# Altium schematic sheet Power.SchDoc: POWER BOARD
size C; DocumentNumber: 32; SheetNumber: 32; SheetTotal: 46
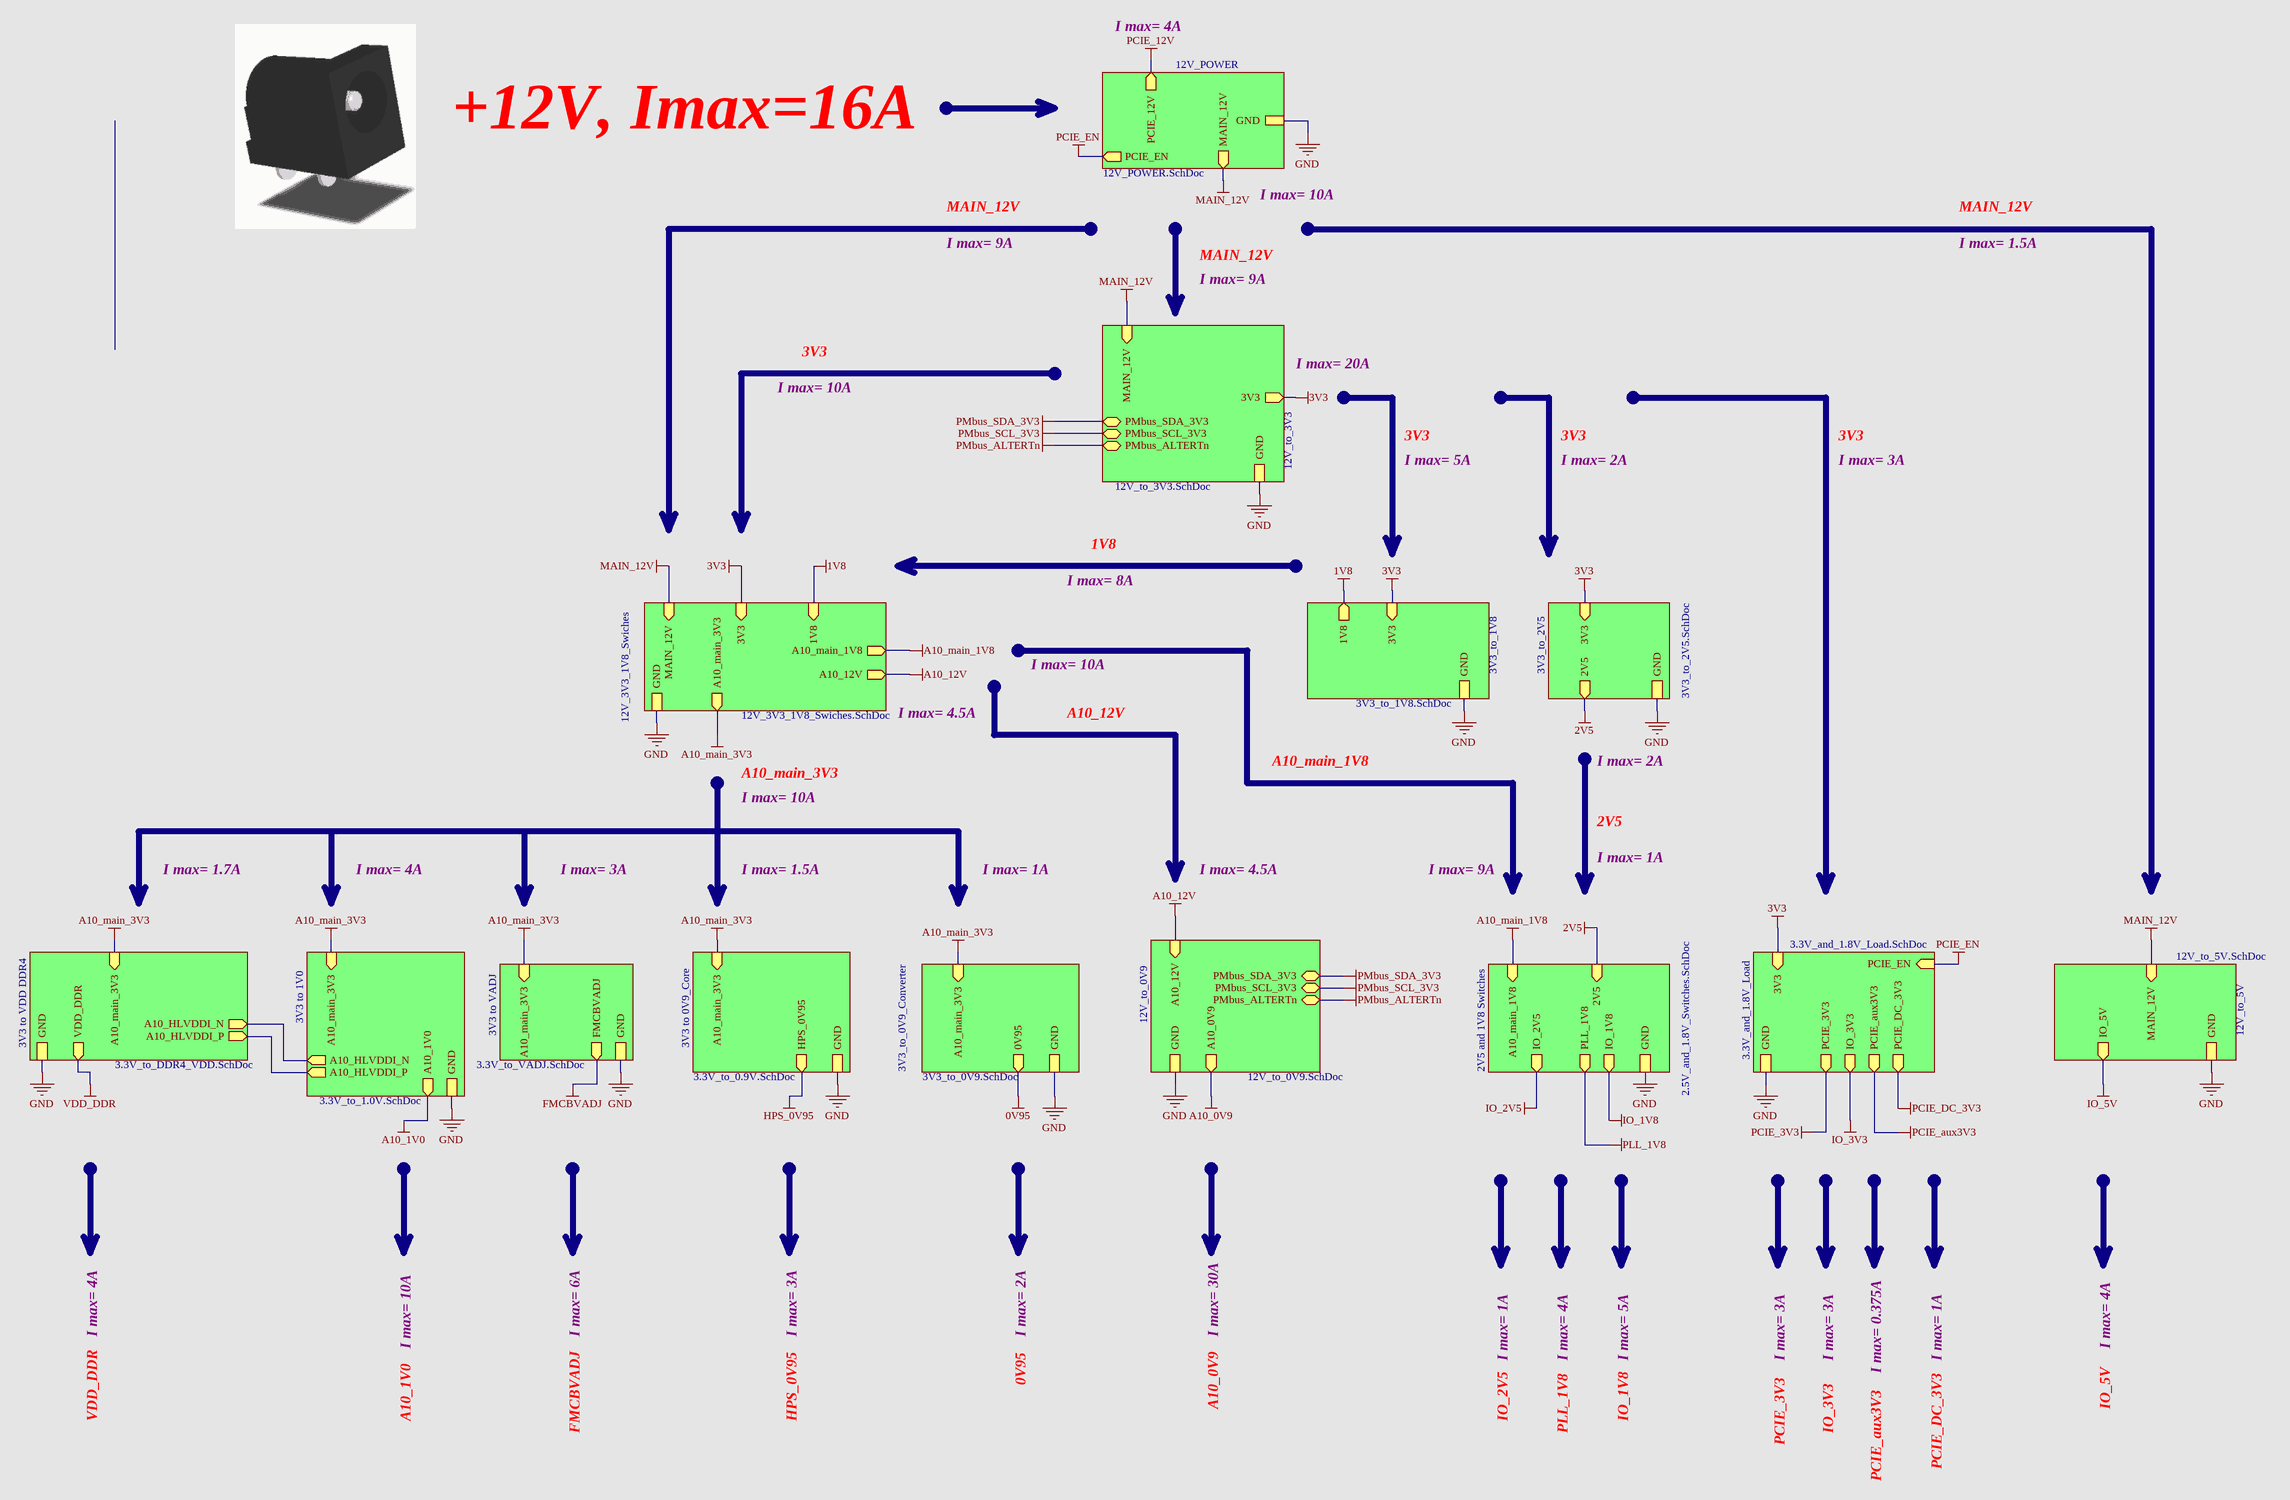
[diagram p0: Power.SchDoc]

## Sub-sheets
2V5 and 1V8 Switches = 2.5V_and_1.8V_Switches.SchDoc: 2V5 (in), IO_2V5 (out), A10_main_1V8 (in), PLL_1V8 (out), IO_1V8 (out), GND
3.3V_and_1.8V_Load = 3.3V_and_1.8V_Load.SchDoc: PCIE_EN (in), 3V3 (in), PCIE_3V3 (out), IO_3V3 (out), PCIE_aux3V3 (out), PCIE_DC_3V3 (out), GND
3V3 to 0V9_Core = 3.3V_to_0.9V.SchDoc: A10_main_3V3 (in), HPS_0V95 (out), GND
3V3 to 1V0 = 3.3V_to_1.0V.SchDoc: A10_HLVDDI_P (out), A10_HLVDDI_N (out), A10_main_3V3 (in), A10_1V0 (out), GND
3V3 to VADJ = 3.3V_to_VADJ.SchDoc: A10_main_3V3 (in), FMCBVADJ (out), GND
3V3 to VDD DDR4 = 3.3V_to_DDR4_VDD.SchDoc: A10_HLVDDI_P (out), A10_HLVDDI_N (out), A10_main_3V3 (in), VDD_DDR (out), GND
3V3_to_0V9_Converter = 3V3_to_0V9.SchDoc: A10_main_3V3 (in), 0V95 (out), GND
3V3_to_1V8 = 3V3_to_1V8.SchDoc: 1V8 (out), 3V3 (in), GND
3V3_to_2V5 = 3V3_to_2V5.SchDoc: 3V3 (in), 2V5 (out), GND
12V_3V3_1V8_Swiches = 12V_3V3_1V8_Swiches.SchDoc: MAIN_12V (in), A10_12V (out), 3V3 (in), A10_main_3V3 (out), 1V8 (in), A10_main_1V8 (out), GND
12V_POWER = 12V_POWER.SchDoc: PCIE_EN (out), MAIN_12V (out), PCIE_12V (out), GND
12V_to_0V9 = 12V_to_0V9.SchDoc: PMbus_SDA_3V3 (bidir), PMbus_SCL_3V3 (bidir), PMbus_ALTERTn (bidir), A10_12V (in), A10_0V9 (out), GND
12V_to_3V3 = 12V_to_3V3.SchDoc: PMbus_SDA_3V3 (bidir), PMbus_SCL_3V3 (bidir), PMbus_ALTERTn (bidir), MAIN_12V (in), 3V3 (out), GND
12V_to_5V = 12V_to_5V.SchDoc: IO_5V (out), MAIN_12V (in), GND

## Nets
0V95: sheet 3V3_to_0V9_Converter/0V95
1V8: sheet 12V_3V3_1V8_Swiches/1V8, sheet 3V3_to_1V8/1V8
2V5: sheet 3V3_to_2V5/2V5, sheet 2V5 and 1V8 Switches/2V5
3V3: sheet 12V_3V3_1V8_Swiches/3V3, sheet 12V_to_3V3/3V3, sheet 3V3_to_2V5/3V3, sheet 3V3_to_1V8/3V3, sheet 3.3V_and_1.8V_Load/3V3
A10_0V9: sheet 12V_to_0V9/A10_0V9
A10_1V0: sheet 3V3 to 1V0/A10_1V0
A10_12V: sheet 12V_3V3_1V8_Swiches/A10_12V, sheet 12V_to_0V9/A10_12V
A10_main_1V8: sheet 12V_3V3_1V8_Swiches/A10_main_1V8, sheet 2V5 and 1V8 Switches/A10_main_1V8
A10_main_3V3: sheet 12V_3V3_1V8_Swiches/A10_main_3V3, sheet 3V3 to 0V9_Core/A10_main_3V3, sheet 3V3 to 1V0/A10_main_3V3, sheet 3V3 to VDD DDR4/A10_main_3V3, sheet 3V3 to VADJ/A10_main_3V3, sheet 3V3_to_0V9_Converter/A10_main_3V3
FMCBVADJ: sheet 3V3 to VADJ/FMCBVADJ
GND: sheet 12V_POWER/GND, sheet 12V_3V3_1V8_Swiches/GND, sheet 12V_to_0V9/GND, sheet 12V_to_3V3/GND, sheet 12V_to_5V/GND, sheet 3V3 to 0V9_Core/GND, sheet 3V3 to 1V0/GND, sheet 3V3 to VDD DDR4/GND, sheet 3V3 to VADJ/GND, sheet 3V3_to_0V9_Converter/GND, sheet 3V3_to_2V5/GND, sheet 3V3_to_1V8/GND, sheet 2V5 and 1V8 Switches/GND, sheet 3.3V_and_1.8V_Load/GND
HPS_0V95: sheet 3V3 to 0V9_Core/HPS_0V95
IO_1V8: sheet 2V5 and 1V8 Switches/IO_1V8
IO_2V5: sheet 2V5 and 1V8 Switches/IO_2V5
IO_3V3: sheet 3.3V_and_1.8V_Load/IO_3V3
IO_5V: sheet 12V_to_5V/IO_5V
MAIN_12V: sheet 12V_POWER/MAIN_12V, sheet 12V_3V3_1V8_Swiches/MAIN_12V, sheet 12V_to_3V3/MAIN_12V, sheet 12V_to_5V/MAIN_12V
PCIE_3V3: sheet 3.3V_and_1.8V_Load/PCIE_3V3
PCIE_12V: sheet 12V_POWER/PCIE_12V
PCIE_aux3V3: sheet 3.3V_and_1.8V_Load/PCIE_aux3V3
PCIE_DC_3V3: sheet 3.3V_and_1.8V_Load/PCIE_DC_3V3
PCIE_EN: sheet 12V_POWER/PCIE_EN, sheet 3.3V_and_1.8V_Load/PCIE_EN
PLL_1V8: sheet 2V5 and 1V8 Switches/PLL_1V8
PMbus_ALTERTn: sheet 12V_to_0V9/PMbus_ALTERTn, sheet 12V_to_3V3/PMbus_ALTERTn
PMbus_SCL_3V3: sheet 12V_to_0V9/PMbus_SCL_3V3, sheet 12V_to_3V3/PMbus_SCL_3V3
PMbus_SDA_3V3: sheet 12V_to_0V9/PMbus_SDA_3V3, sheet 12V_to_3V3/PMbus_SDA_3V3
VDD_DDR: sheet 3V3 to VDD DDR4/VDD_DDR
(unnamed): sheet 3V3 to 1V0/A10_HLVDDI_P, sheet 3V3 to VDD DDR4/A10_HLVDDI_P
(unnamed): sheet 3V3 to 1V0/A10_HLVDDI_N, sheet 3V3 to VDD DDR4/A10_HLVDDI_N

## Notes on the sheet
- I max= 4A
- +12V, Imax=16A
- I max= 10A
- MAIN_12V
- I max= 9A
- I max= 1.5A
- 3V3
- I max= 20A
- I max= 5A
- I max= 2A
- I max= 3A
- 1V8
- I max= 8A
- I max= 4.5A
- A10_12V
- A10_main_3V3
- A10_main_1V8
- I max= 1A
- 2V5
- I max= 1.7A
- I max= 6A
- I max= 30A
- 0V95
- A10_0V9
- I max= 0.375A
- IO_5V
- VDD_DDR
- A10_1V0
- FMCBVADJ
- HPS_0V95
- IO_2V5
- PLL_1V8
- IO_1V8
- PCIE_3V3
- IO_3V3
- PCIE_DC_3V3
- PCIE_aux3V3
- Title
- Size:
- Date:
- File:
- C
- Number:
- Time:
- Revision:
- Sheet
- of